# Altium schematic sheet RfUsbAdapter.SchDoc: RF USB Adapter
size A3; DocumentNumber: 2; Revision: 11; SheetNumber: 2; SheetTotal: 2
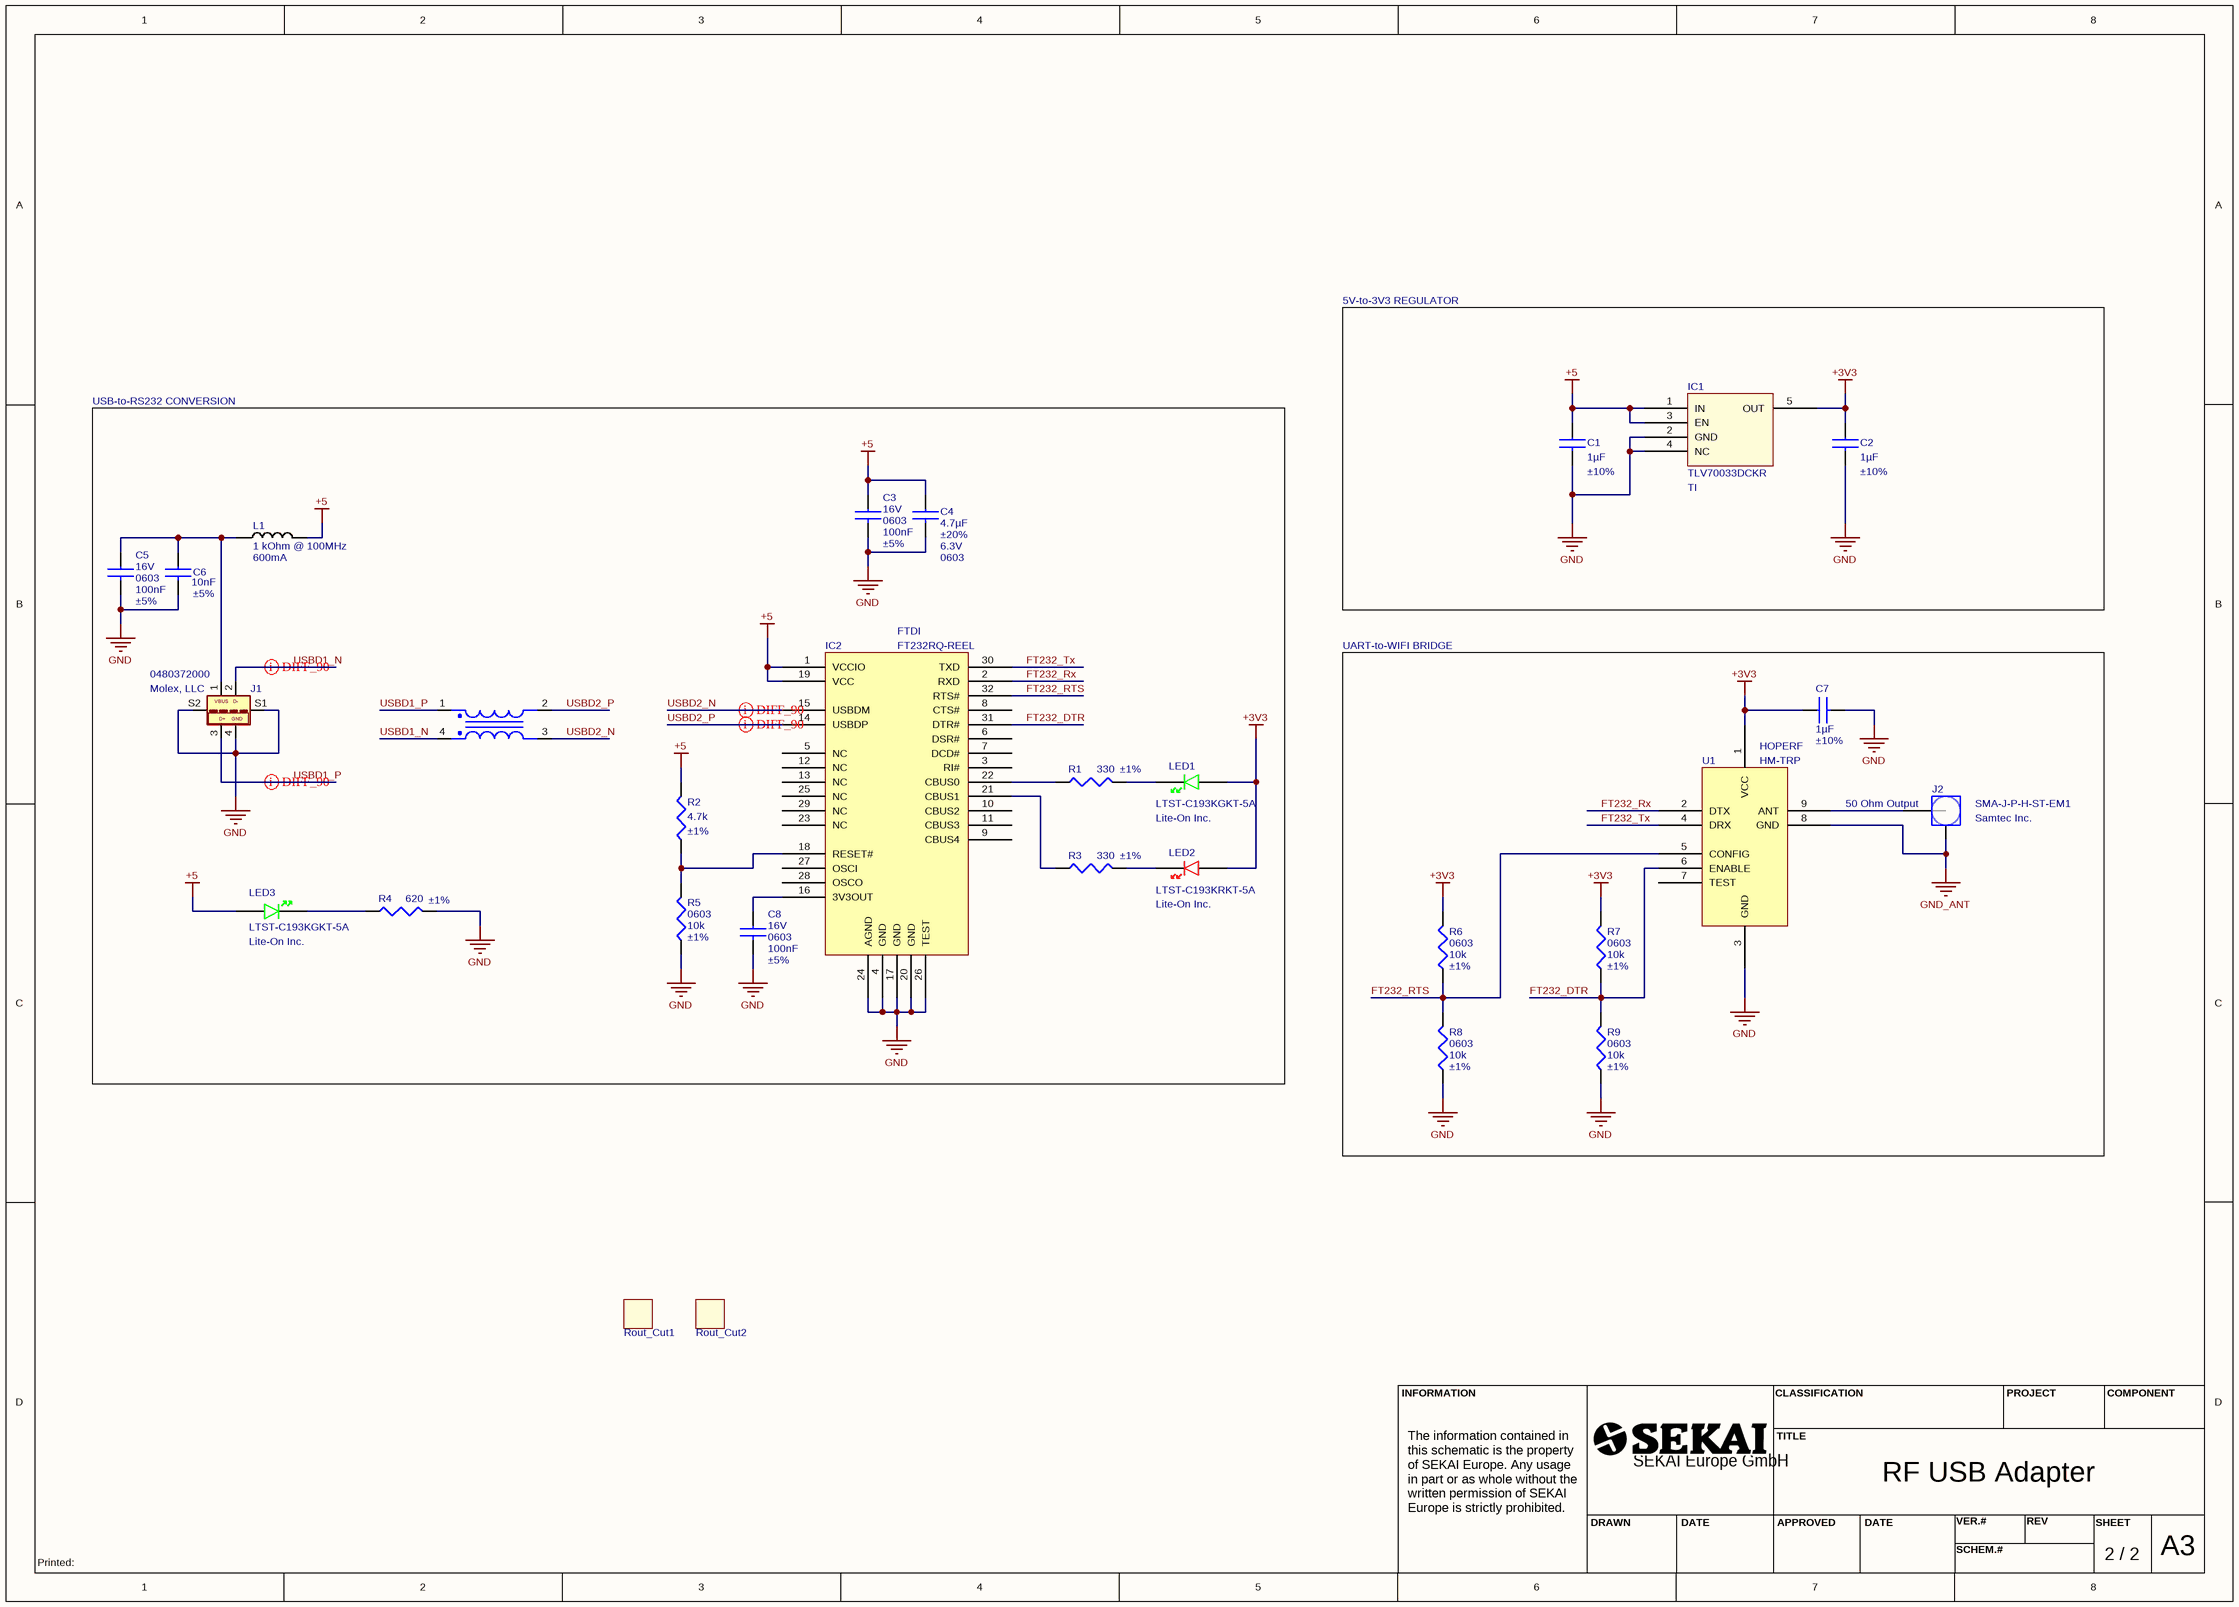
[diagram p0: RfUsbAdapter.SchDoc]

## Parts
C1  Capacitance: 1µF  Tolerance: ±10%  [C0603]  (hidden comment: GRM188R61C105KA93D)
C2  Capacitance: 1µF  Tolerance: ±10%  [C0603]  (hidden comment: GRM188R61C105KA93D)
C3  Spannung - Nennwert: 16V  Gehäuse / Hülle: 0603  Kapazität: 100nF  Toleranz: ±5%  [C0603]  (hidden comment: C0603C104J4RACTU)
C4  Capacitance: 4.7µF  Tolerance: ±20%  Voltage - Rated: 6.3V  Package / Case: 0603  [C0603]  (hidden comment: GRM188R60J475ME19D)
C5  Spannung - Nennwert: 16V  Gehäuse / Hülle: 0603  Kapazität: 100nF  Toleranz: ±5%  [C0603]  (hidden comment: C0603C104J4RACTU)
C6  Kapazität: 10nF  Toleranz: ±5%  [C0603]  (hidden comment: GRM1857U1A103JA44D)
C7  Capacitance: 1µF  Tolerance: ±10%  [C0603]  (hidden comment: GRM188R61C105KA93D)
C8  Spannung - Nennwert: 16V  Gehäuse / Hülle: 0603  Kapazität: 100nF  Toleranz: ±5%  [C0603]  (hidden comment: C0603C104J4RACTU)
IC1  TLV70033DCKR  Manufacturer: TI  [SOT-353]
IC2  FT232RQ-REEL  Manufacturer: FTDI  [QFN32-5x5]
J1  0480372000  Manufacturer: Molex, LLC  [USB TYPE A 2.0]
J2  SMA-J-P-H-ST-EM1  Manufacturer: Samtec Inc.  [SMA-J-P-H-ST-EM1]
L1  Impedance @ Frequency: 1 kOhm @ 100MHz  Current Rating (Max): 600mA  [R0603]  (hidden comment: FBMH1608HM102-T)
L2  DLW21SN121HQ2L  [IND_DLW21S_0805]  (value not drawn)
LED1  LTST-C193KGKT-5A  Manufacturer: Lite-On Inc.  [LED0603-GREEN]
LED2  LTST-C193KRKT-5A  Manufacturer: Lite-On Inc.  [LED0603-RED]
LED3  LTST-C193KGKT-5A  Manufacturer: Lite-On Inc.  [LED0603-GREEN]
R1  Resistance (Ohms): 330  Tolerance: ±1%  [R0603]  (hidden comment: ERJ-3EKF3300V)
R2  Resistance (Ohms): 4.7k  Tolerance: ±1%  [R0603]  (hidden comment: ERJ-3EKF4701V)
R3  Resistance (Ohms): 330  Tolerance: ±1%  [R0603]  (hidden comment: ERJ-3EKF3300V)
R4  Resistance (Ohms): 620  Tolerance: ±1%  [R0603]  (hidden comment: ERJ-3EKF6200V)
R5  Supplier Device Package: 0603  Resistance (Ohms): 10k  Tolerance: ±1%  [R0603]  (hidden comment: ERJ-3EKF1002V)
R6  Supplier Device Package: 0603  Resistance (Ohms): 10k  Tolerance: ±1%  [R0603]  (hidden comment: ERJ-3EKF1002V)
R7  Supplier Device Package: 0603  Resistance (Ohms): 10k  Tolerance: ±1%  [R0603]  (hidden comment: ERJ-3EKF1002V)
R8  Supplier Device Package: 0603  Resistance (Ohms): 10k  Tolerance: ±1%  [R0603]  (hidden comment: ERJ-3EKF1002V)
R9  Supplier Device Package: 0603  Resistance (Ohms): 10k  Tolerance: ±1%  [R0603]  (hidden comment: ERJ-3EKF1002V)
Rout_Cut1  Rout_Cut  [RoutCut]  (value not drawn)
Rout_Cut2  Rout_Cut  [RoutCut]  (value not drawn)
U1  HM-TRP  Manufacturer: HOPERF  [HM-TRP]

## Blocks framed on the sheet
5V-to-3V3 REGULATOR: C1 C2 IC1
USB-to-RS232 CONVERSION: C3-C6 C8 IC2 J1 L1 L2 LED1-LED3 R1-R5

## Nets
+3V3: C2.1 C7.1 IC1.5(OUT) LED1.1(ANODE) LED2.1(ANODE) R6.2 R7.2 U1.1(VCC)
+5: C1.1 C3.1 C4.1 IC1.1(IN) IC1.3(EN) IC2.1(VCCIO) IC2.19(VCC) L1.2 LED3.1(ANODE) R2.2
GND: C1.2 C2.2 C3.2 C4.2 C5.2 C6.2 C7.2 C8.2 IC1.2(GND) IC1.4(NC) IC2.4(GND) IC2.17(GND) IC2.20(GND) IC2.24(AGND) IC2.26(TEST) J1.4(GND) J1.S1 J1.S2 R4.2 R5.1 R8.1 R9.1 U1.3(GND)
GND_ANT: J2.2 U1.8(GND)
FT232_DTR: IC2.31(DTR#) R7.1 R9.2 U1.6(ENABLE)
FT232_RTS: IC2.32(RTS#) R6.1 R8.2 U1.5(CONFIG)
FT232_Rx: IC2.2(RXD) U1.2(DTX)
FT232_Tx: IC2.30(TXD) U1.4(DRX)
USBD1_N: J1.2(D-) L2.4
USBD1_P: J1.3(D+) L2.1
USBD2_N: IC2.15(USBDM) L2.3
USBD2_P: IC2.14(USBDP) L2.2
NetC5_1: C5.1 C6.1 J1.1(VBUS) L1.1
NetC8_1: C8.1 IC2.16(3V3OUT)
NetIC2_18: IC2.18(RESET#) R2.1 R5.2
NetIC2_21: IC2.21(CBUS1) R3.1
NetIC2_22: IC2.22(CBUS0) R1.1
NetJ2_1: J2.1 U1.9(ANT)
NetLED1_2: LED1.2(CATHODE) R1.2
NetLED2_2: LED2.2(CATHODE) R3.2
NetLED3_2: LED3.2(CATHODE) R4.1

Not connected (* = marked no-connect by the designer): IC2 3(RI#) 5(NC) 6(DSR#) 7(DCD#) 8(CTS#) 9(CBUS4) 10(CBUS2) 11(CBUS3) 12(NC) 13(NC) 23(NC) 25(NC) 27(OSCI) 28(OSCO) 29(NC); U1 7(TEST)

## Layout directives
differential pair: USBD1_N, USBD1_P, USBD2_N, USBD2_P

## Notes on the sheet
- UART-to-WIFI BRIDGE
- (near J2) 50 Ohm Output
- INFORMATION
- CLASSIFICATION
- PROJECT
- COMPONENT
- SEKAI Europe GmbH
- TITLE
- The information contained in this schematic is the property of SEKAI Europe. Any usage in part or as whole without the written permission of SEKAI Europe is strictly prohibited.
- DRAWN
- DATE
- APPROVED
- VER.#
- SCHEM.#
- REV
- SHEET
- A3
- Printed:

## Library data of the parts
C1 C2 C7 = GRM188R61C105KA93D: CAP CER 1UF 16V 10% X5R 0603; Manufacturer: Murata Electronics North America; Supplier 1: Digi-Key; Manufacturer Part Number: GRM188R61C105KA93D; RoHS: RoHS Compliant; Category: Capacitors; Stock 1: 349717; Pricing 1: 1=0.15, 10=0.064, 50=0.035, 100=0.0297, 250=0.0242, 500=0.0207, 1000=0.01612 (EUR); Packaging: Cut Tape (CT); Voltage - Rated: 16V; Temperature Coefficient: X5R; Mounting Type: Surface Mount, MLCC; Operating Temperature: -55°C ~ 85°C; Applications: General Purpose; Ratings: -; Package / Case: 0603 (1608 Metric); Size / Dimension: 0.063" L x 0.031" W (1.60mm x 0.80mm); Height - Seated (Max): -; Thickness (Max): 0.035" (0.90mm); Lead Spacing: -; Features: -; Lead Style: -; ComponentLink1URL: http://www.murata.com/~/media/webrenewal/support/library/catalog/products/capacitor/mlcc/c02e.ashx; ComponentLink1Description: http://www.murata.com/~/media/webrenewal/support/library/catalog/products/capacitor/mlcc/c02e.ashx; Supplier Part Number 1: 490-1536-1-ND
C3 C5 C8 = C0603C104J4RACTU: 100nF 16V 5% X7R 0603; Manufacturer: Kemet; Verpackung: Am Band (Cut Tape - CT); Montagetyp: Oberflächenmontage, MLCC; Betriebstemperatur: -55°C bis 125°C; Anwendungen: Mehrzweckanwendungen; Dicke (max.): 0,034" (0,87 mm); Supplier 1: Digi-Key; Manufacturer Part Number: C0603C104J4RACTU; RoHS: RoHS Compliant; Category: Kondensatoren; Stock 1: 557573; Pricing 1: 1=0.11, 10=0.079, 25=0.0584, 50=0.045, 100=0.0372, 250=0.03132, 1000=0.02112 (EUR); Temperaturwirkungsgrad: X7R; Nenngrößen: -; Grösse / Dimension: L x B: 0,063" x 0,031" (1,60 mm x 0,80 mm); Höhe - eingesteckt (max.): -; Rastermaß: -; Funktionen: -; Leitungstyp: -; ComponentLink1URL: http://www.kemet.com/docfinder?Partnumber=C0603C104J4RACTU; ComponentLink1Description: http://www.kemet.com/docfinder?Partnumber=C0603C104J4RACTU; Supplier Part Number 1: 399-1097-1-ND; Supplier 2: Farnell; Supplier Part Number 2: 2479898
C4 = GRM188R60J475ME19D: CAP CER 4.7UF 6.3V X5R 0603; Manufacturer: Murata Electronics North America; Supplier 1: Digi-Key; Manufacturer Part Number: GRM188R60J475ME19D; RoHS: RoHS Compliant; Category: Capacitors; Stock 1: 164000; Pricing 1: 4000=0.02682, 8000=0.02449, 12000=0.02332, 28000=0.02215, 100000=0.01603 (EUR); Packaging: Tape & Reel (TR); Temperature Coefficient: X5R; Mounting Type: Surface Mount, MLCC; Operating Temperature: -55°C ~ 85°C; Applications: General Purpose; Ratings: -; Size / Dimension: 0.063" L x 0.031" W (1.60mm x 0.80mm); Height - Seated (Max): -; Thickness (Max): 0.035" (0.90mm); Lead Spacing: -; Features: -; Lead Style: -; ComponentLink1URL: http://www.murata.com/~/media/webrenewal/support/library/catalog/products/capacitor/mlcc/c02e.pdf; ComponentLink1Description: http://www.murata.com/~/media/webrenewal/support/library/catalog/products/capacitor/mlcc/c02e.pdf; Supplier Part Number 1: 490-5421-2-ND
C6 = GRM1857U1A103JA44D: CAP CER 10NF 10V 5% U2J 0603; Manufacturer: Murata Electronics North America; Verpackung: Am Band (Cut Tape - CT); Montagetyp: Oberflächenmontage, MLCC; Betriebstemperatur: -55°C bis 125°C; Anwendungen: Mehrzweckanwendungen; Gehäuse / Hülle: 0603 (1608 Metrisch); Dicke (max.): 0,020" (0,50 mm); Supplier 1: Digi-Key; Manufacturer Part Number: GRM1857U1A103JA44D; RoHS: RoHS Compliant; Category: Kondensatoren; Stock 1: 14578; Pricing 1: 1=0.23, 10=0.155, 25=0.112, 50=0.0934, 100=0.0785, 250=0.06356, 500=0.05608, 1000=0.04673 (EUR); Spannung - Nennwert: 10V; Temperaturwirkungsgrad: U2J; Nenngrößen: -; Grösse / Dimension: L x B: 0,063" x 0,031" (1,60 mm x 0,80 mm); Höhe - eingesteckt (max.): -; Rastermaß: -; Funktionen: -; Leitungstyp: -; ComponentLink1URL: http://www.murata.com/~/media/webrenewal/support/library/catalog/products/capacitor/mlcc/c02e.ashx; ComponentLink1Description: http://www.murata.com/~/media/webrenewal/support/library/catalog/products/capacitor/mlcc/c02e.ashx; Supplier Part Number 1: 490-8269-1-ND
IC1 = TLV70033DCKR: IC REG LDO 3.3V 0.2A SC70-5; Regulator Topology: Positive Fixed; Current - Output: 200mA; Number of Regulators: 1; Voltage - Input: Up to 5.5V; Current - Limit (Min): 220mA; Supplier 1: Digi-Key; Manufacturer Part Number: TLV70033DCKR; RoHS: RoHS Compliant; Category: Integrated Circuits (ICs); Stock 1: 9685; Pricing 1: 1=0.48, 10=0.411, 100=0.3069, 500=0.2411, 1000=0.18587 (EUR); Packaging: Cut Tape (CT); Part Status: Active; Voltage - Output: 3.3V; Voltage - Dropout (Typical): -; Operating Temperature: -40°C ~ 125°C; Mounting Type: Surface Mount; Package / Case: 5-TSSOP, SC-70-5, SOT-353; Supplier Device Package: SC-70-5; ComponentLink1URL: http://www.ti.com/lit/ds/slvsa00e/slvsa00e.pdf; ComponentLink1Description: http://www.ti.com/lit/ds/slvsa00e/slvsa00e.pdf; Supplier Part Number 1: 296-32413-1-ND
IC2 = FT232RQ-REEL: IC USB FS SERIAL UART 32-QFN; Function: Bridge, USB to UART; Standards: USB 2.0; Voltage - Supply: 3.3 V ~ 5.25 V; Current - Supply: 15mA; Supplier 1: Digi-Key; Manufacturer Part Number: FT232RQ-REEL; RoHS: RoHS Compliant; Category: Integrated Circuits (ICs); Stock 1: 72090; Pricing 1: 1=4.05, 10=3.645, 50=3.4654, 100=3.2854, 250=2.92532, 500=2.56528, 1000=2.38527 (EUR); Packaging: Digi-Reel®; Part Status: Active; Protocol: USB; Interface: UART; Operating Temperature: -40°C ~ 85°C; Package / Case: 32-VFQFN Exposed Pad; Supplier Device Package: 32-QFN Exposed Pad (5x5); ComponentLink1URL: http://www.ftdichip.com/Support/Documents/DataSheets/ICs/DS_FT232R.pdf; ComponentLink1Description: http://www.ftdichip.com/Support/Documents/DataSheets/ICs/DS_FT232R.pdf; Supplier Part Number 1: 768-1008-6-ND
J1 = 0480372000: CONN PLUG USB 4POS R/A SMD; Connector Type: USB - A; Number of Contacts: 4; Supplier 1: Digi-Key; Manufacturer Part Number: 0480372000; RoHS: RoHS Compliant; Category: Connectors, Interconnects; Stock 1: 7499; Pricing 1: 1=1.34, 10=1.182, 25=1.1124, 50=1.0662, 100=1.0198 (EUR); Packaging: Cut Tape (CT); Part Status: Active; Gender: Plug; Specifications: -; Mounting Type: Surface Mount, Right Angle, Horizontal; Features: Board Lock, Shielded; Ingress Protection: -; ComponentLink1URL: http://www.molex.com/pdm_docs/sd/480372000_sd.pdf; ComponentLink1Description: http://www.molex.com/pdm_docs/sd/480372000_sd.pdf; Supplier Part Number 1: WM7086CT-ND
J2 = SMA-J-P-H-ST-EM1: CONN SMA JACK 50 OHM EDGE MNT; Connector Type: Jack, Female Socket; Contact Termination: Solder; Impedance: 50 Ohm; Frequency - Max: 20GHz; Body Material: Brass; Body Finish: Gold; Center Contact Material: Beryllium Copper; Dielectric Material: Polytetrafluoroethylene (PTFE); Voltage Rating: 335V; Supplier 1: Digi-Key; Manufacturer Part Number: SMA-J-P-H-ST-EM1; RoHS: RoHS Compliant; Category: Connectors, Interconnects; Stock 1: 369; Pricing 1: 1=4.05, 10=3.426, 50=2.9586, 100=2.6472, 250=2.33576, 500=2.18004, 1000=2.02432, 2500=1.94647, 5000=1.90754 (EUR); Packaging: Tray; Part Status: Active; Connector Style: SMA; Shield Termination: Solder; Mounting Type: Board Edge, End Launch; Cable Group: -; Fastening Type: Threaded; Features: -; Housing Color: Gold; Ingress Protection: -; Center Contact Plating: Gold; Operating Temperature: -65°C ~ 125°C; ComponentLink1URL: http://suddendocs.samtec.com/prints/sma-j-p-x-st-em1-mkt.pdf; ComponentLink1Description: http://suddendocs.samtec.com/prints/sma-j-p-x-st-em1-mkt.pdf; Supplier Part Number 1: SAM8857-ND
L1 = FBMH1608HM102-T: FERRITE BEAD 1 KOHM 0603 1LN; Manufacturer: Taiyo Yuden; Filter Type: Power Line; Number of Lines: 1; DC Resistance (DCR) (Max): 350 mOhm; Supplier 1: Digi-Key; Manufacturer Part Number: FBMH1608HM102-T; RoHS: RoHS Compliant; Category: Filters; Stock 1: 100000; Pricing 1: 4000=0.01972, 8000=0.01787, 12000=0.01726, 28000=0.01602 (EUR); Packaging: Tape & Reel (TR); Ratings: -; Operating Temperature: -40°C ~ 125°C; Package / Case: 0603 (1608 Metric); Mounting Type: Surface Mount; Height (Max): 0.035" (0.90mm); Size / Dimension: 0.063" L x 0.031" W (1.60mm x 0.80mm); ComponentLink1URL: http://ds.yuden.co.jp/TYCOMPAS/ut/detail.do?productNo=FBMH1608HM102-T&fileName=FBMH1608HM102-T_SS&mode=specSheetDownload; ComponentLink1Description: http://ds.yuden.co.jp/TYCOMPAS/ut/detail.do?productNo=FBMH1608HM102-T&fileName=FBMH1608HM102-T_SS&mode=specSheetDownload; Supplier Part Number 1: 587-1739-2-ND
L2 = DLW21SN121HQ2L: CHOKE COIL COMMON MODE 280MA SMD; Manufacturer: Murata Electronics North America; Filter Type: Data, Signal Line; Number of Lines: 2; DC Resistance (DCR): 410 mOhm Max; Impedance: 120 Ohm; Supplier 1: Digi-Key; Manufacturer Part Number: DLW21SN121HQ2L; RoHS: RoHS Compliant; Category: Filters; Stock 1: 5520; Pricing 1: 1=0.68, 10=0.602, 25=0.5652, 50=0.4898, 100=0.4521, 250=0.42952, 500=0.39184, 750=0.34663, 1000=0.33155 (EUR); Packaging: Cut Tape (CT); Inductance: -; Current: 280mA; Operating Temperature: -40°C ~ 85°C; Mounting Type: Surface Mount; Size / Dimension: 0.079" L x 0.047" W (2.00mm x 1.20mm); Height (Max): 0.055" (1.40mm); Package / Case: Horizontal, 4 PC Pad; ComponentLink1URL: http://search.murata.co.jp/Ceramy/image/img/PDF/ENG/L0114S0133DLW21S.pdf; ComponentLink1Description: http://search.murata.co.jp/Ceramy/image/img/PDF/ENG/L0114S0133DLW21S.pdf; Supplier Part Number 1: 490-5135-1-ND
LED1 LED3 = LTST-C193KGKT-5A: LED GREEN CLEAR 0603 SMD; Wavelength - Dominant: 572nm; Wavelength - Peak: 574nm; Millicandela Rating: 16.25mcd; Voltage - Forward (Vf) (Typ): 2V; Current - Test: 5mA; Viewing Angle: 130°; Lens Color: Colorless; Lens Style/Size: Rectangle with Flat Top, 1.15mm x 0.80mm; Supplier 1: Digi-Key; Manufacturer Part Number: LTST-C193KGKT-5A; RoHS: RoHS Compliant; Category: Optoelectronics; Stock 1: 64103; Pricing 1: 1=0.38, 10=0.276, 100=0.1461, 250=0.10336, 500=0.0882, 1000=0.0689 (EUR); Packaging: Digi-Reel®; Color: Green; Lens Transparency: Clear; Package / Case: 0603 (1608 Metric); Supplier Device Package: *; Size / Dimension: 1.60mm L x 0.80mm W; Height (Max): 0.35mm; Mounting Type: Surface Mount; ComponentLink1URL: http://optoelectronics.liteon.com/upload/download/DS22-2007-0094/S_110_LTST-C193KGKT-5A.pdf; ComponentLink1Description: http://optoelectronics.liteon.com/upload/download/DS22-2007-0094/S_110_LTST-C193KGKT-5A.pdf; Supplier Part Number 1: 160-1828-6-ND
LED2 = LTST-C193KRKT-5A: LED RED CLEAR 0603 SMD; Wavelength - Dominant: 631nm; Wavelength - Peak: 639nm; Millicandela Rating: 26.05mcd; Voltage - Forward (Vf) (Typ): 2V; Current - Test: 5mA; Viewing Angle: 130°; Lens Color: Colorless; Lens Style/Size: Rectangle with Flat Top, 1.15mm x 0.80mm; Supplier 1: Digi-Key; Manufacturer Part Number: LTST-C193KRKT-5A; RoHS: RoHS Compliant; Category: Optoelectronics; Stock 1: 115770; Pricing 1: 1=0.38, 10=0.276, 100=0.1461, 250=0.10336, 500=0.0882, 1000=0.0689 (EUR); Packaging: Cut Tape (CT); Color: Red; Lens Transparency: Clear; Package / Case: 0603 (1608 Metric); Supplier Device Package: *; Size / Dimension: 1.60mm L x 0.80mm W; Height (Max): 0.35mm; Mounting Type: Surface Mount; ComponentLink1URL: http://optoelectronics.liteon.com/upload/download/DS22-2005-077/S_110_LTST-C193KRKT-5A.pdf; ComponentLink1Description: http://optoelectronics.liteon.com/upload/download/DS22-2005-077/S_110_LTST-C193KRKT-5A.pdf; Supplier Part Number 1: 160-1830-1-ND
R1 R3 = ERJ-3EKF3300V: RES SMD 330 OHM 1% 1/10W 0603; Manufacturer: Panasonic Electronic Components; Power (Watts): 0.1W, 1/10W; Temperature Coefficient: ±100ppm/°C; Supplier 1: Digi-Key; Manufacturer Part Number: ERJ-3EKF3300V; RoHS: RoHS Compliant; Category: Resistors; Stock 1: 360334; Pricing 1: 1=0.1, 50=0.0154, 100=0.0117, 250=0.00864, 500=0.00638, 1000=0.00426, 2500=0.0036 (EUR); Packaging: Cut Tape (CT); Composition: Thick Film; Features: Automotive AEC-Q200; Operating Temperature: -55°C ~ 155°C; Package / Case: 0603 (1608 Metric); Supplier Device Package: 0603; Size / Dimension: 0.063" L x 0.031" W (1.60mm x 0.80mm); Height: 0.022" (0.55mm); Number of Terminations: 2; ComponentLink1URL: http://industrial.panasonic.com/www-cgi/jvcr13pz.cgi?E+PZ+3+AOA0002+ERJ3EKF3300V+7+WW; ComponentLink1Description: http://industrial.panasonic.com/www-cgi/jvcr13pz.cgi?E+PZ+3+AOA0002+ERJ3EKF3300V+7+WW; Supplier Part Number 1: P330HCT-ND
R2 = ERJ-3EKF4701V: RES SMD 4.7K OHM 1% 1/10W 0603; Manufacturer: Panasonic Electronic Components; Power (Watts): 0.1W, 1/10W; Temperature Coefficient: ±100ppm/°C; Supplier 1: Digi-Key; Manufacturer Part Number: ERJ-3EKF4701V; RoHS: RoHS Compliant; Category: Resistors; Stock 1: 1341800; Pricing 1: 1=0.1, 50=0.0154, 100=0.0117, 250=0.00864, 500=0.00638, 1000=0.00426, 2500=0.0036 (EUR); Packaging: Cut Tape (CT); Composition: Thick Film; Features: Automotive AEC-Q200; Operating Temperature: -55°C ~ 155°C; Package / Case: 0603 (1608 Metric); Supplier Device Package: 0603; Size / Dimension: 0.063" L x 0.031" W (1.60mm x 0.80mm); Height: 0.022" (0.55mm); Number of Terminations: 2; ComponentLink1URL: http://industrial.panasonic.com/www-cgi/jvcr13pz.cgi?E+PZ+3+AOA0002+ERJ3EKF4701V+7+WW; ComponentLink1Description: http://industrial.panasonic.com/www-cgi/jvcr13pz.cgi?E+PZ+3+AOA0002+ERJ3EKF4701V+7+WW; Supplier Part Number 1: P4.70KHCT-ND
R4 = ERJ-3EKF6200V: 620 OHM 1% 1/10W 0603; Manufacturer: Panasonic Electronic Components; Power (Watts): 0.1W, 1/10W; Temperature Coefficient: ±100ppm/°C; Supplier 1: Digi-Key; Manufacturer Part Number: ERJ-3EKF6200V; RoHS: RoHS Compliant; Category: Resistors; Stock 1: 39617; Pricing 1: 1=0.1, 50=0.0154, 100=0.0117, 250=0.00864, 500=0.00638, 1000=0.00426, 2500=0.0036 (EUR); Packaging: Cut Tape (CT); Composition: Thick Film; Features: Automotive AEC-Q200; Operating Temperature: -55°C ~ 155°C; Package / Case: 0603 (1608 Metric); Supplier Device Package: 0603; Size / Dimension: 0.063" L x 0.031" W (1.60mm x 0.80mm); Height: 0.022" (0.55mm); Number of Terminations: 2; ComponentLink1URL: http://industrial.panasonic.com/www-cgi/jvcr13pz.cgi?E+PZ+3+AOA0002+ERJ3EKF6200V+7+WW; ComponentLink1Description: http://industrial.panasonic.com/www-cgi/jvcr13pz.cgi?E+PZ+3+AOA0002+ERJ3EKF6200V+7+WW; Supplier Part Number 1: P620HCT-ND
R5-R9 = ERJ-3EKF1002V: 10K OHM 1% 1/10W 0603; Manufacturer: Panasonic Electronic Components; Power (Watts): 0.1W, 1/10W; Temperature Coefficient: ±100ppm/°C; Supplier 1: Digi-Key; Manufacturer Part Number: ERJ-3EKF1002V; RoHS: RoHS Compliant; Category: Resistors; Stock 1: 4844013; Pricing 1: 1=0.1, 50=0.0154, 100=0.0117, 250=0.00864, 500=0.00638, 1000=0.00426, 2500=0.0036 (EUR); Packaging: Cut Tape (CT); Composition: Thick Film; Features: Automotive AEC-Q200; Operating Temperature: -55°C ~ 155°C; Package / Case: 0603 (1608 Metric); Size / Dimension: 0.063" L x 0.031" W (1.60mm x 0.80mm); Height: 0.022" (0.55mm); Number of Terminations: 2; ComponentLink1URL: http://industrial.panasonic.com/www-cgi/jvcr13pz.cgi?E+PZ+3+AOA0002+ERJ3EKF1002V+7+WW; ComponentLink1Description: http://industrial.panasonic.com/www-cgi/jvcr13pz.cgi?E+PZ+3+AOA0002+ERJ3EKF1002V+7+WW; Supplier Part Number 1: P10.0KHCT-ND
Rout_Cut1 Rout_Cut2 = Rout_Cut: 1.6mm